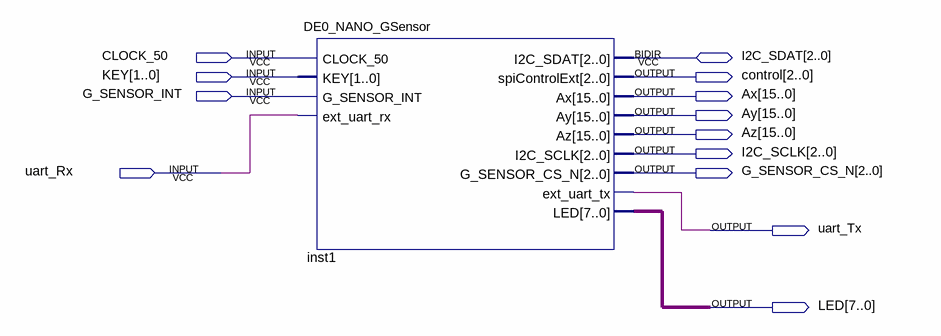
[diagram p0: schematic sheet]
// Quartus schematic adxl.bdf as structural Verilog: 1 symbols, 13 pins
module adxl (
  input  CLOCK_50,
  input  [1:0] KEY,
  input  G_SENSOR_INT,
  input  uart_Rx,
  inout  [2:0] I2C_SDAT,
  output [2:0] control,
  output [15:0] Ax,
  output [15:0] Ay,
  output [15:0] Az,
  output [2:0] I2C_SCLK,
  output [2:0] G_SENSOR_CS_N,
  output uart_Tx,
  output [7:0] LED
);

  DE0_NANO_GSensor inst1 (
    .CLOCK_50(CLOCK_50), .KEY(KEY), .G_SENSOR_INT(G_SENSOR_INT), .ext_uart_rx(uart_Rx),
    .spiControlExt(control), .Ax(Ax), .Ay(Ay), .Az(Az), .I2C_SCLK(I2C_SCLK), .G_SENSOR_CS_N(G_SENSOR_CS_N),
    .ext_uart_tx(uart_Tx), .LED(LED), .I2C_SDAT(I2C_SDAT));
endmodule
